# EAGLE design Martin-V-USB_Mame_Panel_Atmega8ISP-V30-final (EAGLE 7.3.0)
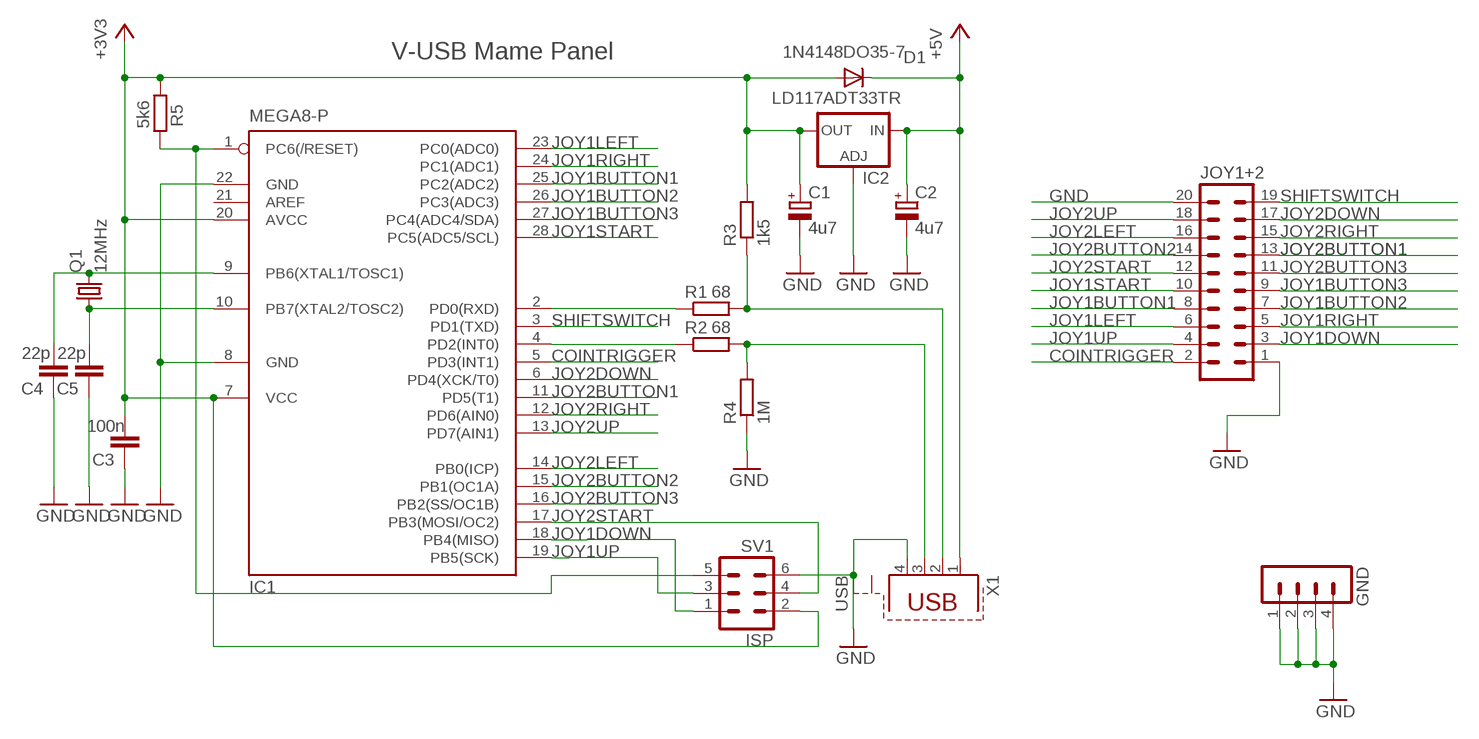
[diagram p0: schematic, sheet 1]

## Parts
C1  4u7  CPOL-EUE2.5-5  [E2,5-5]
C2  4u7  CPOL-EUE2.5-5  [E2,5-5]
C3  100n  C-EU050-030X075  [C050-030X075]
C4  22p  C-EU025-025X050  [C025-025X050]
C5  22p  C-EU025-025X050  [C025-025X050]
D1  1N4148DO35-7  [DO35-7]
GND  MA04-1  [MA04-1]
IC1  MEGA8-P  [DIL28-3]
IC2  LD117ADT33TR  [DPACK]
JOY1+2  MA10-2  [MA10-2]
Q1  12MHz  CRYSTALHC18U-V  [HC18U-V]
R1  68  R-EU_0207/10  [0207/10]
R2  68  R-EU_0207/10  [0207/10]
R3  1k5  R-EU_0207/10  [0207/10]
R4  1M  R-EU_0207/10  [0207/10]
R5  5k6  R-EU_0207/10  [0207/10]
SV1  ISP  ML6  [ML6]
X1  USB  PN61729-S  [PN61729-S]

## Nets
+3V3 [power]: C1.+ C3.2 D1.A IC1.7(VCC) IC1.20(AVCC) IC2.4(OUT) R3.2 R5.1 SV1.2
+5V [power]: C2.+ D1.C IC2.3(IN) X1.1
COINTRIGGER: IC1.5(PD3(INT1)) JOY1+2.2
GND [power]: C1.- C2.- C3.1 C4.1 C5.1 GND.1 GND.2 GND.3 GND.4 IC1.8(GND) IC1.22(GND) IC2.1(ADJ) JOY1+2.1 JOY1+2.20 R4.1 SV1.6 X1.4
JOY1BUTTON1: IC1.25(PC2(ADC2)) JOY1+2.8
JOY1BUTTON2: IC1.26(PC3(ADC3)) JOY1+2.7
JOY1BUTTON3: IC1.27(PC4(ADC4/SDA)) JOY1+2.9
JOY1DOWN: IC1.18(PB4(MISO)) JOY1+2.3 SV1.1
JOY1LEFT: IC1.23(PC0(ADC0)) JOY1+2.6
JOY1RIGHT: IC1.24(PC1(ADC1)) JOY1+2.5
JOY1START: IC1.28(PC5(ADC5/SCL)) JOY1+2.10
JOY1UP: IC1.19(PB5(SCK)) JOY1+2.4 SV1.3
JOY2BUTTON1: IC1.11(PD5(T1)) JOY1+2.13
JOY2BUTTON2: IC1.15(PB1(OC1A)) JOY1+2.14
JOY2BUTTON3: IC1.16(PB2(SS/OC1B)) JOY1+2.11
JOY2DOWN: IC1.6(PD4(XCK/T0)) JOY1+2.17
JOY2LEFT: IC1.14(PB0(ICP)) JOY1+2.16
JOY2RIGHT: IC1.12(PD6(AIN0)) JOY1+2.15
JOY2START: IC1.17(PB3(MOSI/OC2)) JOY1+2.12 SV1.4
JOY2UP: IC1.13(PD7(AIN1)) JOY1+2.18
N$1: IC1.2(PD0(RXD)) R1.1
N$2: IC1.4(PD2(INT0)) R2.1
N$3: IC1.1(PC6(/RESET)) R5.2 SV1.5
N$4: R1.2 R3.1 X1.2
N$5: R2.2 R4.2 X1.3
N$10: C4.2 IC1.9(PB6(XTAL1/TOSC1)) Q1.2
N$11: C5.2 IC1.10(PB7(XTAL2/TOSC2)) Q1.1
SHIFTSWITCH: IC1.3(PD1(TXD)) JOY1+2.19
Unconnected: IC1.21(AREF) X1.S1 X1.S2

## Notes on the sheet
- V-USB Mame Panel

## Library data of the parts
C1 C2 = rcl:CPOL-EU: POLARIZED CAPACITOR, European symbol
C3-C5 = resistor:C-EU: CAPACITOR, European symbol
D1 = diode:1N4148: DIODE high speed (Philips)
GND = con-lstb:MA04-1: PIN HEADER; OC_FARNELL: unknown; OC_NEWARK: unknown
IC1 = atmel:MEGA8-P: MICROCONTROLLER 8 Kbytes FLASH, 1 kbytes SRAM, 512 bytes EEPROM, USART, 4-channel 10 bit ADC, 2-channel 8 bit ADC Pin compatible with Atmega48, ATMega88, ATMega168 Source: avr.lbr
IC2 = v-reg:LD117A?*: Low drop fixed and adjustable positive voltage regulators 1 A Source: http://www.st.com/stonline/products/literature/ds/7194/ld1117axx.pdf
JOY1+2 = con-lstb:MA10-2: PIN HEADER; OC_FARNELL: unknown; OC_NEWARK: unknown
Q1 = crystal:CRYSTAL: CRYSTAL
R1 R3-R5 = resistor:R-EU_: RESISTOR, European symbol
R2 = rcl:R-EU_: RESISTOR, European symbol
SV1 = con-harting-ml:ML6: HARTING
X1 = con-berg:PN61729-S: BERG USB connector; OC_FARNELL: unknown; OC_NEWARK: unknown

## Net classes
0 default: width 0.254 mm
1 power: width 0.813 mm

## Board
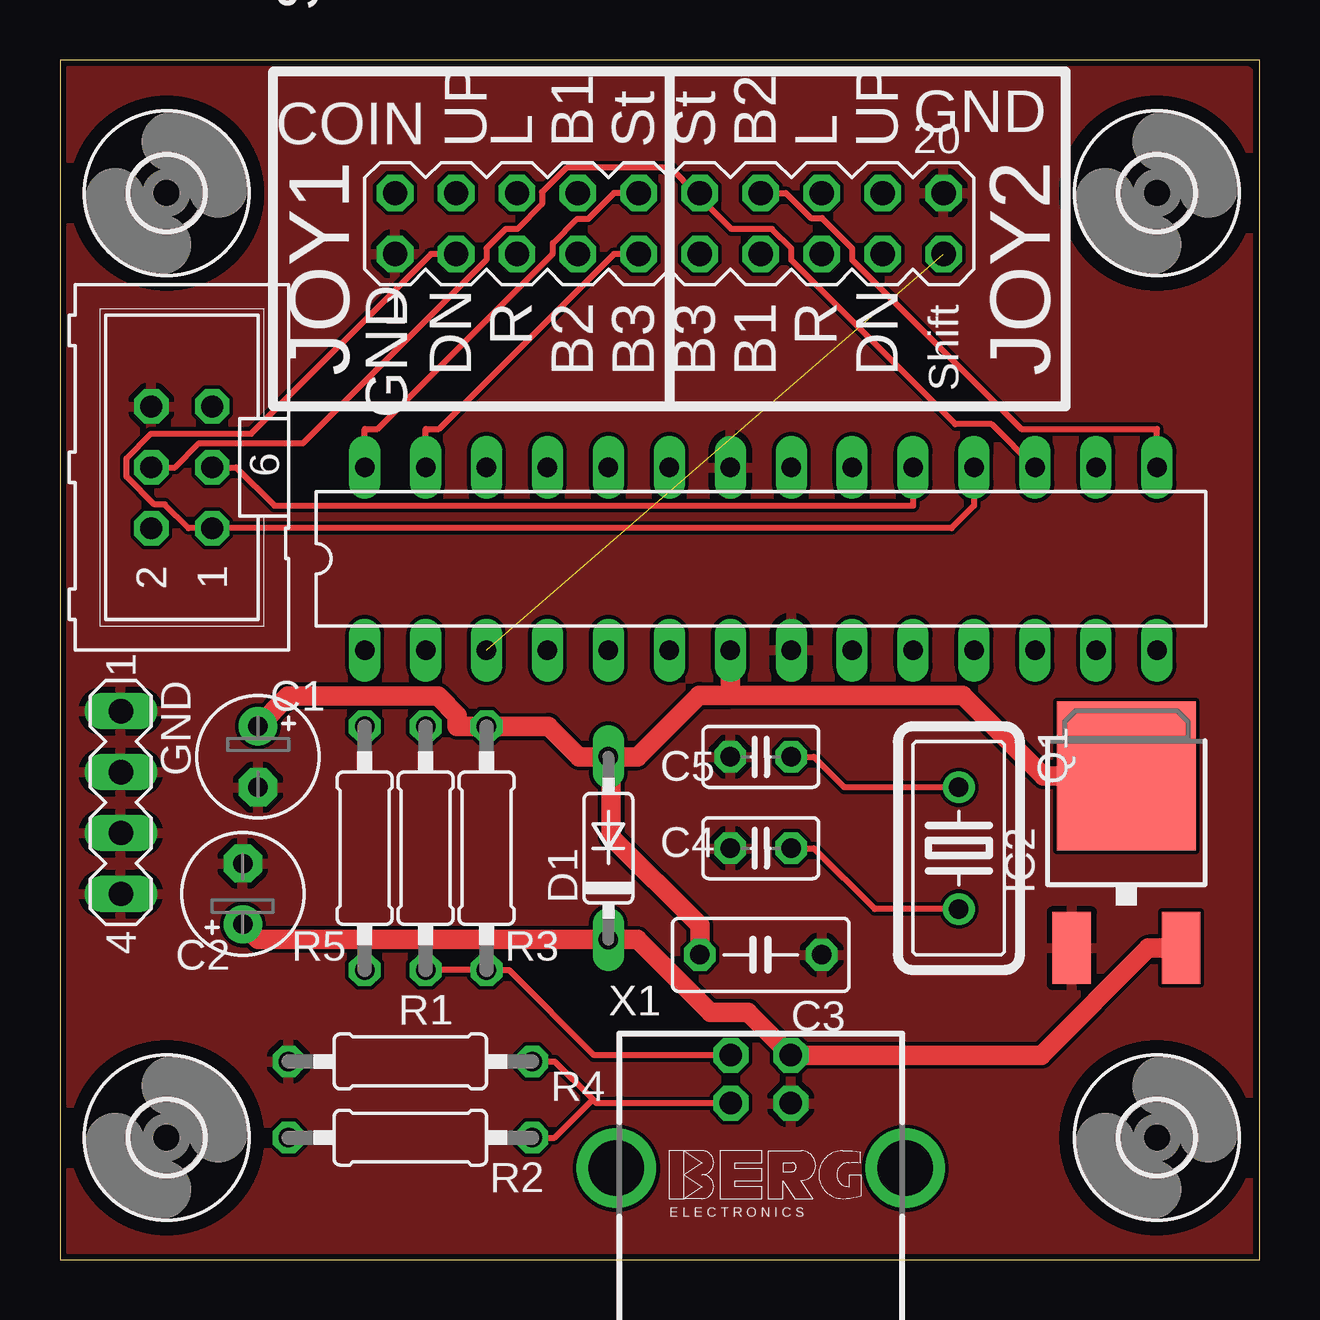
[diagram p1: board, top side]
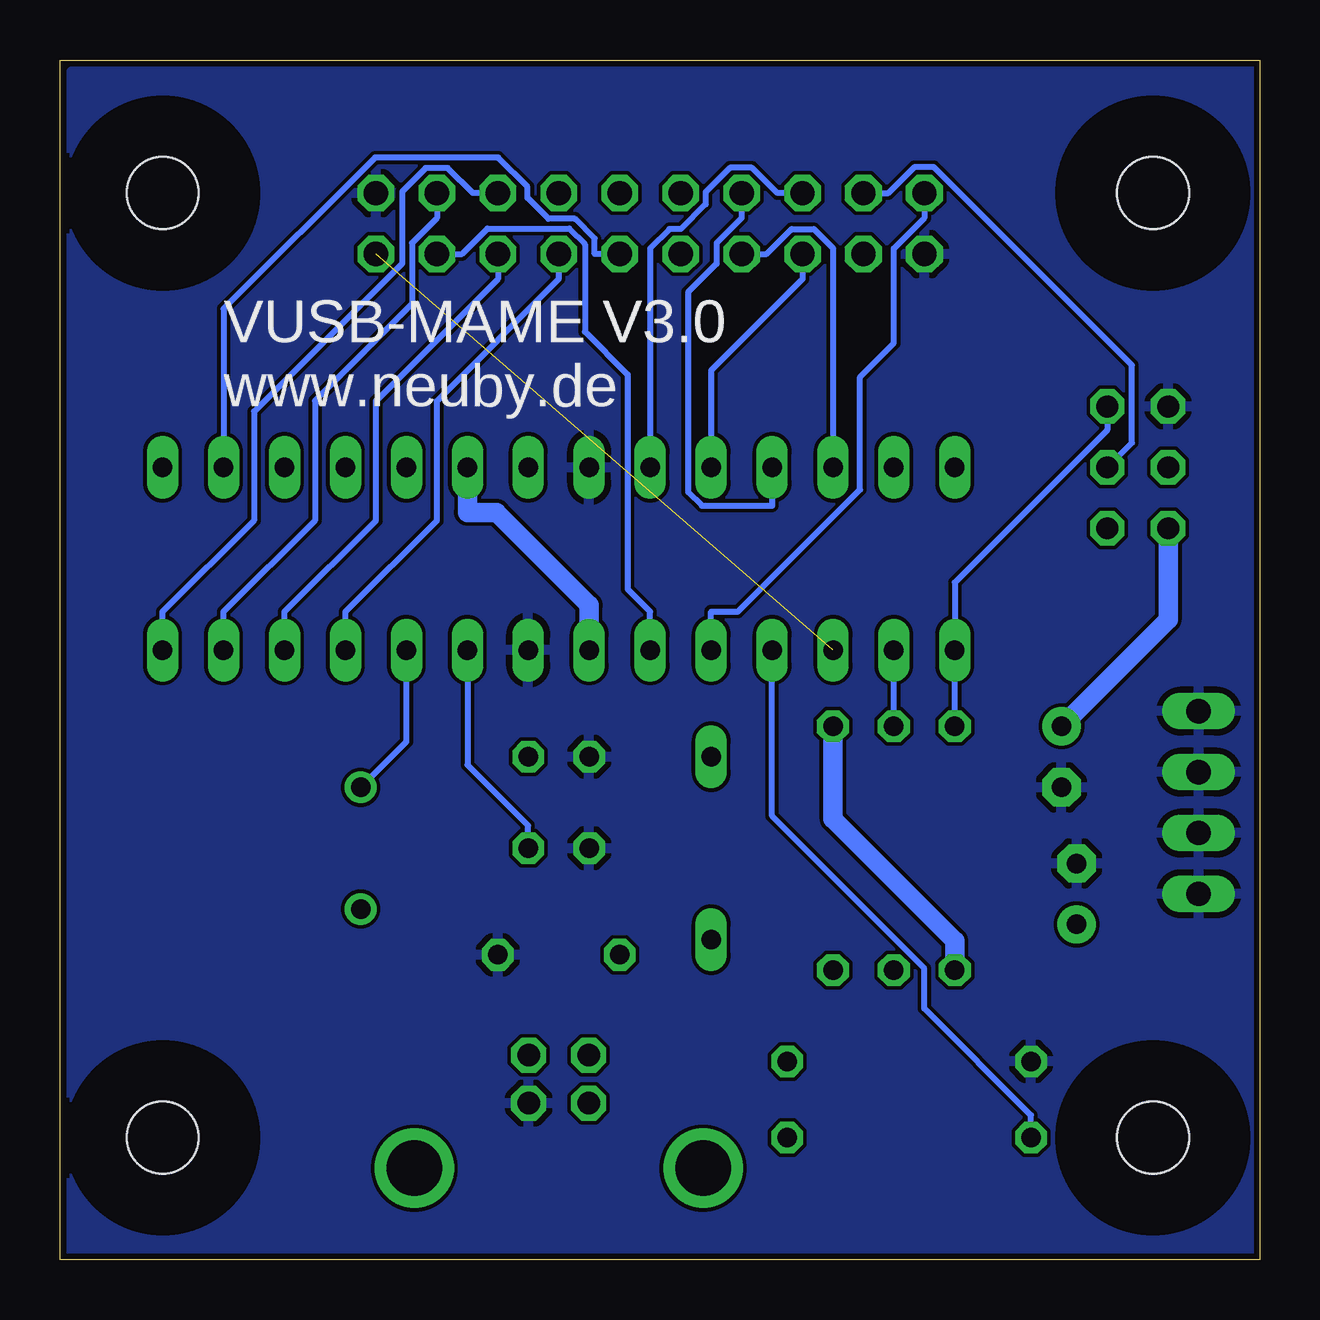
[diagram p2: board, bottom side, seen from below]

Size 50 x 50 mm. Coordinates in mm from the lower left corner, seen from the top.
Outline: 0,0 50,0 50,50 0,50 0,0
Copper layers (1*16): Top 0.035mm / dielectric 1.5mm / Bottom 0.035mm
Design rules "Fusion_eagle_rule_v1.1": minimum track width 6mil, minimum drill 12mil, track to track 6mil, track to pad 6mil, pad to pad 6mil, via to via 6mil, smd to smd 0mil, copper to edge 10mil, drill to drill 10mil, minimum pad ring 10mil, minimum via ring 6mil, stop-mask expansion 2mil, vias tented up to drill 100mil, thermal gap 10mil

### Footprints (pad centres in the part's own frame; a part is rotated, then mirrored left to right if it is on the bottom)
E2,5-5 = drill 0.813 pad 1.6: + -1.27,0 | drill 0.813 pad 1.6 octagon: - 1.27,0
C050-030X075 = drill 0.813 octagon: 1 -2.54,0; 2 2.54,0
C025-025X050 = drill 0.813 octagon: 1 -1.27,0; 2 1.27,0
DO35-7 = drill 0.813 long: A 3.81,0; C -3.81,0
MA04-1 = drill 1.016 long: 1 -3.81,0; 2 -1.27,0; 3 1.27,0; 4 3.81,0
DIL28-3 = drill 0.813 long: 1 -16.51,-3.81; 2 -13.97,-3.81; 3 -11.43,-3.81; 4 -8.89,-3.81; 5 -6.35,-3.81; 6 -3.81,-3.81; 7 -1.27,-3.81; 8 1.27,-3.81; 9 3.81,-3.81; 10 6.35,-3.81; 11 8.89,-3.81; 12 11.43,-3.81; 13 13.97,-3.81; 14 16.51,-3.81; 15 16.51,3.81; 16 13.97,3.81; 17 11.43,3.81; 18 8.89,3.81; 19 6.35,3.81; 20 3.81,3.81; 21 1.27,3.81; 22 -1.27,3.81; 23 -3.81,3.81; 24 -6.35,3.81; 25 -8.89,3.81; 26 -11.43,3.81; 27 -13.97,3.81; 28 -16.51,3.81
DPACK = smd 1.6 x 3: 1 -2.28,-4.8; 3 2.28,-4.8 | smd 5.8 x 6.2: 4 0,2.38
MA10-2 = drill 1.016 octagon: 1 -11.43,-1.27; 2 -11.43,1.27; 3 -8.89,-1.27; 4 -8.89,1.27; 5 -6.35,-1.27; 6 -6.35,1.27; 7 -3.81,-1.27; 8 -3.81,1.27; 9 -1.27,-1.27; 10 -1.27,1.27; 11 1.27,-1.27; 12 1.27,1.27; 13 3.81,-1.27; 14 3.81,1.27; 15 6.35,-1.27; 16 6.35,1.27; 17 8.89,-1.27; 18 8.89,1.27; 19 11.43,-1.27; 20 11.43,1.27
HC18U-V = drill 0.813: 1 -2.54,0; 2 2.54,0
0207/10 = drill 0.813 octagon: 1 -5.08,0; 2 5.08,0
ML6 = drill 0.914 octagon: 1 -2.54,-1.27; 2 -2.54,1.27; 3 0,-1.27; 4 0,1.27; 5 2.54,-1.27; 6 2.54,1.27
3,0 = hole 3: 0,0
PN61729-S = drill 0.95 octagon: 1 1.25,4.71; 2 -1.25,4.71; 3 -1.25,2.71; 4 1.25,2.71 | drill 2.3 pad 2.9: S1 -6.02,0; S2 6.02,0

### Placement (x,y rotation side)
C1  8.26,20.95 270 top
C2  7.62,15.24 90 top
C3  29.21,12.7 180 top
C4  29.21,17.14 0 top
C5  29.21,20.95 0 top
D1  22.86,17.14 90 top
GND  2.54,19.05 270 top
IC1  29.21,29.21 0 top
IC2  44.45,17.78 0 top
JOY1+2  25.4,43.18 0 top
Q1  37.47,17.14 270 top
R1  15.24,17.14 270 top
R2  14.61,5.08 0 top
R3  17.78,17.14 90 top
R4  14.61,8.26 0 top
R5  12.7,17.14 90 top
SV1  5.08,33.02 90 top
U$1  [3,0]  4.45,5.08 0 top
U$2  [3,0]  45.72,44.45 0 top
U$3  [3,0]  4.45,44.45 0 top
U$4  [3,0]  45.72,5.08 0 top
X1  29.21,3.81 0 top

### Tracks (layer width: path | path; a pad name or v marks a point on that pad's centre or on a via)
+3V3
  Top 0.813: C3.2 26.67,13.92 22.97,17.61 22.97,20.95 | 22.97,20.95 24.08,20.95 26.64,23.52 27.94,23.52 | 22.97,20.95 D1.A 22.76,20.95 21.64,20.95 20.37,22.23 R3.2 16.56,22.23 16.56,22.68 15.76,23.48 9.51,23.48 C1.+ | IC2.4 40.99,20.16 37.63,23.52 27.94,23.52 | IC1.7 27.94,23.52
  Bottom 0.813: IC1.20 33.02,31.14 31.8,31.14 27.94,27.28 IC1.7 | R5.1 12.7,13.28 17.78,18.36 R3.2 | SV1.2 3.81,26.67 C1.+
+5V
  Top 0.813: C2.+ 8.26,13.34 D1.C 24.08,13.34 27.11,10.3 28.68,10.3 X1.1 40.91,8.52 45.37,12.98 IC2.3
COINTRIGGER
  Bottom 0.254: JOY1+2.2 13.97,43.41 15.24,42.14 15.24,38.2 16.65,36.79 16.65,32.09 21.74,27 22.86,27 IC1.5
GND
  pour Bottom: 0,0 0,49.53 49.53,49.53 49.53,0
  pour Top: 0,49.53 0,0 49.53,0 49.53,49.53
  pour Bottom: 0,0 0,49.53 49.53,49.53 49.53,0
JOY1BUTTON1
  Bottom 0.254: IC1.25 20.32,31.42 23.25,31.42 23.82,31.99 23.82,40.32 22.63,41.5 22.63,42.37 21.59,43.41 JOY1+2.8
JOY1BUTTON2
  Bottom 0.254: JOY1+2.7 20.55,41.91 19.51,42.95 18.58,42.95 17.78,42.15 IC1.26
JOY1BUTTON3
  Top 0.254: JOY1+2.9 23.09,41.91 15.8,34.62 15.24,34.62 IC1.27
JOY1DOWN
  Top 0.254: JOY1+2.3 15.47,41.91 7.98,34.42 3.79,34.42 2.77,33.4 2.77,32.63 3.94,31.47 4.37,31.47 5.36,30.48 SV1.1 37.16,30.48 38.1,31.42 IC1.18
JOY1LEFT
  Bottom 0.254: JOY1+2.6 20.09,44.45 21.15,45.51 22.07,45.51 23.09,44.49 23.09,43.98 24.12,42.95 24.6,42.95 25.4,42.15 IC1.23
JOY1RIGHT
  Bottom 0.254: JOY1+2.5 19.05,40.87 22.86,37.06 IC1.24
JOY1START
  Top 0.254: JOY1+2.10 23.09,44.45 22.02,43.38 21.56,43.38 20.55,42.37 20.55,41.94 13.23,34.62 12.7,34.62 IC1.28
JOY1UP
  Top 0.254: IC1.19 35.56,31.42 8.94,31.42 7.34,33.02 SV1.3
  Bottom 0.254: JOY1+2.4 15.47,44.45 14.38,45.54 13.58,45.54 5.32,37.28 5.32,34.05 SV1.3
JOY2BUTTON1
  Bottom 0.254: JOY1+2.13 29.21,40.87 34.29,35.79 34.29,30.81 38.1,27 IC1.11
JOY2BUTTON2
  Top 0.254: IC1.15 45.72,34.62 40.07,34.62 33.02,41.67 33.02,42.15 31.76,43.41 31.29,43.41 30.25,44.45 JOY1+2.14
JOY2BUTTON3
  Bottom 0.254: JOY1+2.11 27.71,41.91 27.71,42.56 28.53,43.38 29.64,43.38 30.51,44.25 30.51,44.71 31.74,45.94 36.87,45.94 43.18,39.63 IC1.16
JOY2DOWN
  Bottom 0.254: IC1.6 25.4,27 26.34,27.94 26.34,36.89 28.12,38.67 28.12,42.31 28.78,42.98 32.18,42.98 33.25,41.91 JOY1+2.17
JOY2LEFT
  Bottom 0.254: IC1.14 45.72,27 41.91,30.81 41.91,35.34 35.74,41.52 35.74,44.52 34.76,45.49 33.83,45.49 32.79,44.45 JOY1+2.16
JOY2RIGHT
  Bottom 0.254: JOY1+2.15 31.75,40.87 36.83,35.79 36.83,30.81 40.64,27 IC1.12
JOY2START
  Top 0.254: SV1.4 4.8,33.02 5.79,34.01 10.12,34.01 17.78,41.67 17.78,42.15 18.58,42.95 19.06,42.95 20.09,43.98 20.09,44.49 21.11,45.51 25.44,45.51 26.5,44.45 | IC1.17 38.84,34.82 37.32,34.82 30.48,41.66 30.48,42.15 29.68,42.95 27.99,42.95 26.5,44.45 | JOY1+2.12 26.5,44.45
JOY2UP
  Bottom 0.254: IC1.13 43.18,27 39.37,30.81 39.37,35.8 35.33,39.84 35.33,42.37 34.29,43.41 JOY1+2.18
N$1
  Bottom 0.254: R1.1 IC1.2
N$2
  Bottom 0.254: R2.1 9.53,6.02 13.97,10.46 13.97,12.13 20.32,18.48 IC1.4
N$3
  Bottom 0.254: R5.2 IC1.1 12.7,28.22 6.35,34.57 SV1.5
N$4
  Top 0.254: X1.2 22.27,8.52 18.72,12.06 R3.1 R1.2
N$5
  Top 0.254: 22.21,6.67 20.62,8.26 R4.2 | X1.3 22.36,6.52 22.21,6.67 | 22.21,6.67 20.62,5.08 R2.2
N$10
  Top 0.254: C4.2 31.42,17.14 33.96,14.61 Q1.2
  Bottom 0.254: C4.2 30.48,18.09 33.02,20.62 IC1.9
N$11
  Top 0.254: C5.2 31.42,20.95 32.69,19.68 Q1.1
  Bottom 0.254: Q1.1 35.56,21.59 IC1.10
SHIFTSWITCH  (1 unrouted)

### Text on the board
tNames: SH | COIN | GND | UP | L | B1 | St | St | B2 | L | UP | GND | R | R | JOY1 | DN | B2 | B3 | B3 | B1 | DN | JOY2 | Shift
bNames: VUSB-MAME V3.0 / www.neuby.de